# Altium schematic sheet F0_BUCK_2021-12-07.schdoc
size 321 x 215 mm
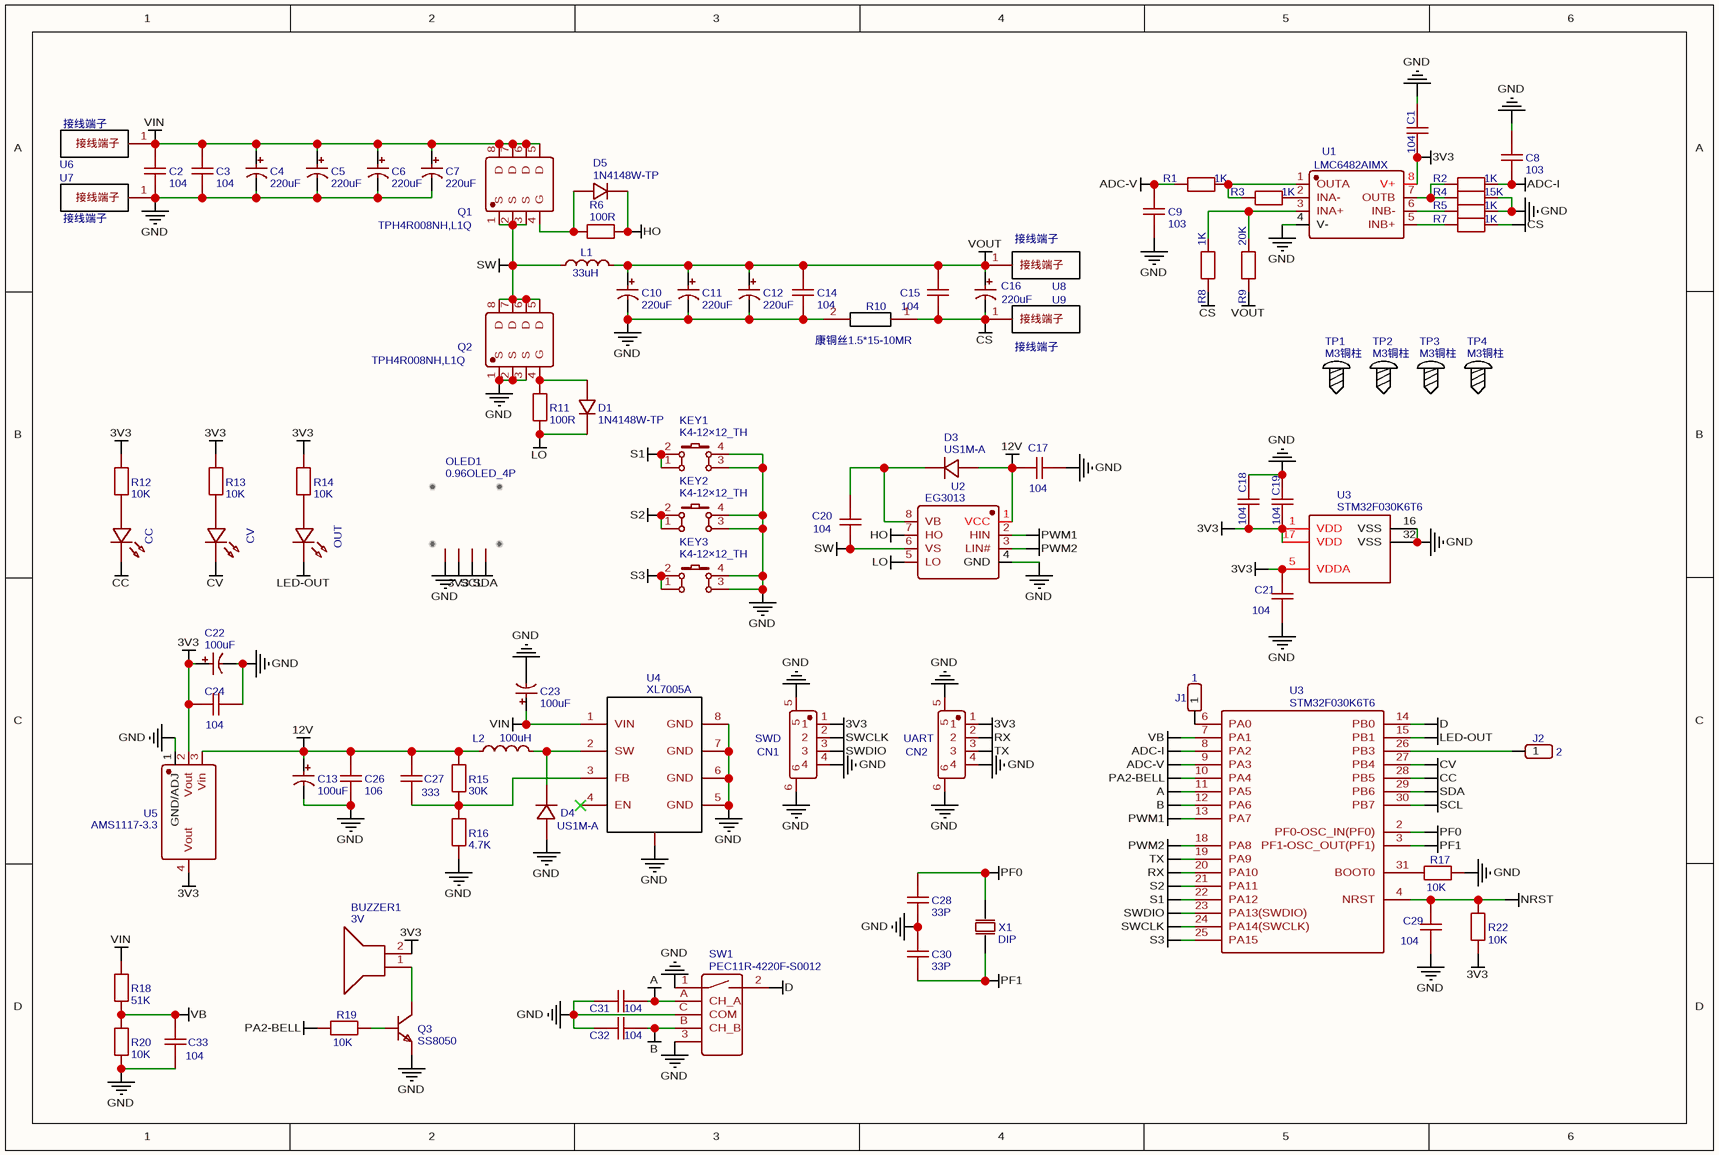
[diagram p0: F0_BUCK_2021-12-07.schdoc]

## Parts
(Parts that share a designator on the sheet are numbered #1, #2 ... from top to bottom, then left to right.)
BUZZER1  3V  [BUZ-TH_BD12.5-P6.50-D0.9]
C1  104  [C0603]
C2  104  [C1206]
C3  104  [C1206]
C4  220uF  [CAP-TH_BD10.0-P5.00-D1.0-FD]
C5  220uF  [CAP-TH_BD10.0-P5.00-D1.0-FD]
C6  220uF  [CAP-TH_BD10.0-P5.00-D1.0-FD]
C7  220uF  [CAP-TH_BD10.0-P5.00-D1.0-FD]
C8  103  [C0603]
C9  103  [C0603]
C10  220uF  [CAP-TH_BD10.0-P5.00-D1.0-FD]
C11  220uF  [CAP-TH_BD10.0-P5.00-D1.0-FD]
C12  220uF  [CAP-TH_BD10.0-P5.00-D1.0-FD]
C13  100uF  [CAP-TH_BD8.0-P3.50-D1.0-FD]
C14  104  [C1206]
C15  104  [C1206]
C16  220uF  [CAP-TH_BD10.0-P5.00-D1.0-FD]
C17  104  [C0603]
C18  104  [C0603]
C19  104  [C0603]
C20  104  [C0603]
C21  104  [C0603]
C22  100uF  [CAP-TH_BD8.0-P3.50-D1.0-FD]
C23  100uF  [CAP-TH_BD8.0-P3.50-D1.0-FD]
C24  104  [C0603]
C26  106  [C0805]
C27  333  [C0603]
C28  33P  [C0603]
C29  104  [C0603]
C30  33P  [C0603]
C31  104  [C0603]
C32  104  [C0603]
C33  104  [C0603]
CC  CC  [LED-TH_BD3.0_RED]  (value not drawn)
CN1  SWD  [CONN-SMD_1.5-4P-LT]
CN2  UART  [CONN-SMD_1.5-4P-LT]
CV  LED-TH-3mm_G  [LED-TH_BD3.0_GREEN]  (value not drawn)
D1  1N4148W-TP  [SOD-123_L2.8-W1.8-LS3.7-RD]
D3  US1M-A  [SMA_L4.4-W2.8-LS5.4-RD]
D4  US1M-A  [SMA_L4.4-W2.8-LS5.4-RD]
D5  1N4148W-TP  [SOD-123_L2.8-W1.8-LS3.7-RD]
J1  1  [HDR-M-2.54_1X1]
J2  2  [HDR-M-2.54_1X1]
KEY1  K4-12×12_TH  [KEY-TH_4P-L12.0-W12.0-P5.00-LS12.5]
KEY2  K4-12×12_TH  [KEY-TH_4P-L12.0-W12.0-P5.00-LS12.5]
KEY3  K4-12×12_TH  [KEY-TH_4P-L12.0-W12.0-P5.00-LS12.5]
L1  33uH  [IND-TH_L29.0-W12.0-P10.00]
L2  100uH  [IND-SMD_L7.1-W7.0]
OLED1  0.96OLED_4P  [0.96OLED_4P]
OUT  OUT  [LED-TH_BD3.0_BLUE]  (value not drawn)
Q1  TPH4R008NH,L1Q  [POWERVDFN-8_L5.0-W5.0-P1.27-LS6.0-BL]
Q2  TPH4R008NH,L1Q  [POWERVDFN-8_L5.0-W5.0-P1.27-LS6.0-BL]
Q3  SS8050  [SOT-23-3_L2.9-W1.3-P1.90-LS2.4-BR]
R1  1K  [R0603]
R2  1K  [R0603]
R3  1K  [R0603]
R4  15K  [R0603]
R5  1K  [R0603]
R6  100R  [R0603]
R7  1K  [R0603]
R8  1K  [R0603]
R9  20K  [R0603]
R10  康铜丝1.5*15-10MR  [康铜丝1.5*15-10MR]
R11  100R  [R0603]
R12  10K  [R0603]
R13  10K  [R0603]
R14  10K  [R0603]
R15  30K  [R0603]
R16  4.7K  [R0603]
R17  10K  [R0603]
R18  51K  [R0603]
R19  10K  [R0603]
R20  10K  [R0603]
R22  10K  [R0603]
SW1  PEC11R-4220F-S0012  [SW-TH_PEC11R-4220F-S0012]
TP1  M3铜柱  [M3铜柱]
TP2  M3铜柱  [M3铜柱]
TP3  M3铜柱  [M3铜柱]
TP4  M3铜柱  [M3铜柱]
U1  LMC6482AIMX  [SOIC-8_L4.9-W3.9-P1.27-LS6.0-BL]
U2  EG3013  [SOP-8_L5.0-W4.0-P1.27-LS6.2-BL]
U3#1  STM32F030K6T6  [TQFP-32_L7.0-W7.0-P0.50-BL]
U3#2  STM32F030K6T6  [TQFP-32_L7.0-W7.0-P0.50-BL]
U4  XL7005A  [SOIC-8_L5.0-W4.0-P1.27-LS6.0-BL-EP]
U5  AMS1117-3.3  [SOT-223-3_L6.5-W3.4-P2.30-LS7.0-BR]
U6  接线端子  [4MM端子]
U7  接线端子  [4MM端子]
U8  接线端子  [4MM端子]
U9  接线端子  [4MM端子]
X1  DIP  [HC-49US_L11.5-W4.5-P4.88]

## Nets
3V3: BUZZER1.2 C1.1 C18.1 C19.1 C21.2 C22.1 C24.2 CN1.1 CN2.1 OLED1.2 R12.2 R13.2 R14.2 R22.1 U1.8(V+) U3#1.1(VDD) U3#1.5(VDDA) U3#1.17(VDD) U5.2(Vout) U5.4(Vout)
12V: C13.1 C17.1 C26.2 C27.2 D3.2(A) L2.1 R15.2 U2.1(VCC) U5.3(Vin)
A: C31.1 SW1.A(CH_A) U3#2.11(PA5)
ADC-I: C8.1 R2.2 U3#2.8(PA2)
ADC-V: C9.2 R1.1 U3#2.9(PA3)
B: C32.1 SW1.B(CH_B) U3#2.12(PA6)
CC: CC.2 U3#2.28(PB5)
CS: C15.1 C16.2 R7.2 R8.1 R10.1 U9.1(接线端子)
CV: CV.2 U3#2.27(PB4)
D: SW1.2 U3#2.14(PB0)
GND: C1.2 C2.1 C3.1 C4.2 C5.2 C6.2 C7.2 C8.2 C9.1 C10.2 C11.2 C12.2 C13.2 C14.1 C17.2 C18.2 C19.2 C21.1 C22.2 C23.2 C24.1 C26.1 C28.1 C29.1 C30.2 C31.2 C32.2 C33.1 CN1.4 CN1.5 CN1.6 CN2.4 CN2.5 CN2.6 D4.2(A) KEY1.3 KEY1.4 KEY2.3 KEY2.4 KEY3.3 KEY3.4 OLED1.1 Q2.1(S) Q2.2(S) Q2.3(S) Q3.2(E) R4.2 R5.2 R10.2 R16.1 R17.2 R20.1 SW1.1 SW1.3 SW1.C(COM) U1.4(V-) U2.4(GND) U3#1.16(VSS) U3#1.32(VSS) U4.5(GND) U4.6(GND) U4.7(GND) U4.8(GND) U4.9 U5.1(GND/ADJ) U7.1(接线端子)
HO: D5.1(c) R6.1 U2.7(HO)
LED-OUT: OUT.2 U3#2.15(PB1)
LO: D1.1(c) R11.1 U2.5(LO)
NRST: C29.2 R22.2 U3#2.4(NRST)
PA2-BELL: R19.1 U3#2.10(PA4)
PF0: C28.2 U3#2.2(PF0-OSC_IN(PF0)) X1.2(OSC2)
PF1: C30.1 U3#2.3(PF1-OSC_OUT(PF1)) X1.1(OSC1)
PWM1: U2.2(HIN) U3#2.13(PA7)
PWM2: U2.3(LIN#) U3#2.18(PA8)
RX: CN2.2 U3#2.20(PA10)
S1: KEY1.1 KEY1.2 U3#2.22(PA12)
S2: KEY2.1 KEY2.2 U3#2.21(PA11)
S3: KEY3.1 KEY3.2 U3#2.25(PA15)
SCL: OLED1.3 U3#2.30(PB7)
SDA: OLED1.4 U3#2.29(PB6)
SW: C20.2 L1.1 Q1.1(S) Q1.2(S) Q1.3(S) Q2.5(D) Q2.6(D) Q2.7(D) Q2.8(D) U2.6(VS)
SWCLK: CN1.2 U3#2.24(PA14(SWCLK))
SWDIO: CN1.3 U3#2.23(PA13(SWDIO))
TX: CN2.3 U3#2.19(PA9)
VB: C33.2 R18.1 R20.2 U3#2.7(PA1)
VIN: C2.2 C3.2 C4.1 C5.1 C6.1 C7.1 C23.1 Q1.5(D) Q1.6(D) Q1.7(D) Q1.8(D) R18.2 U4.1(VIN) U6.1(接线端子)
VOUT: C10.1 C11.1 C12.1 C14.2 C15.2 C16.1 L1.2 R9.1 U8.1(接线端子)
NetBUZZER1_1: BUZZER1.1 Q3.3(C)
NetC20_1: C20.1 D3.1(C) U2.8(VB)
NetC27_1: C27.1 R15.1 R16.2 U4.3(FB)
NetCC_1: CC.1 R12.1
NetCV_1: CV.1 R13.1
NetD1_2: D1.2(A) Q2.4(G) R11.2
NetD4_1: D4.1(C) L2.2 U4.2(SW)
NetD5_2: D5.2(A) Q1.4(G) R6.2
NetJ1_1: J1.1 U3#2.6(PA0)
NetJ2_1: J2.1 U3#2.26(PB3)
NetOUT_1: OUT.1 R14.1
NetQ3_1: Q3.1(B) R19.2
NetR1_2: R1.2 R3.1 U1.1(OUTA)
NetR2_1: R2.1 R4.1 U1.7(OUTB)
NetR3_2: R3.2 U1.2(INA-)
NetR5_1: R5.1 U1.6(INB-)
NetR7_1: R7.1 U1.5(INB+)
NetR8_2: R8.2 R9.2 U1.3(INA+)
NetR17_1: R17.1 U3#2.31(BOOT0)

Not connected (* = marked no-connect by the designer): U4 4(EN)*

## Notes on the sheet
- (in symbol 0.96OLED_4P) Hello World!!!

## Library data of the parts
BUZZER1 = 3V: BOM_Manufacturer: ZLFY; BOM_Manufacturer Part: ZL-YDW12055-4005PA-6.5; Contributor: LCSC; BOM_Supplier: LCSC; BOM_Supplier Part: C219731; BOM_JLCPCB Part Class: Extended Part; spicePre: B; spiceSymbolName: ZL-YDW12055-4005PA-6.5
C1-C3 C14 C15 C17-C21 C24 C29 C31-C33 = 104: nameAlias: Value(F); Contributor: LCEDA_Lib; spicePre: C
  C1 C17-C21 C24 C29 C31-C33: spiceSymbolName: C_0603_US
  C2 C3 C14 C15: spiceSymbolName: C_1206_US
C4-C7 C10-C12 C16 = 220uF: BOM_Manufacturer: ValuePro; BOM_Manufacturer Part: 220uF 50V 10*13; nameAlias: Capacitance; BOM_Supplier: LCSC; BOM_Supplier Part: C45105; BOM_JLCPCB Part Class: Extended Part; spicePre: C; spiceSymbolName: 220uF 50V 10*13
C8 C9 = 103: nameAlias: Value(F); Contributor: LCEDA_Lib; spicePre: C; spiceSymbolName: C_0603_US
C13 C22 C23 = 100uF: BOM_Manufacturer: ValuePro; BOM_Manufacturer Part: 100uF 50V 8*12Black high frequency; nameAlias: Capacitance; BOM_Supplier: LCSC; BOM_Supplier Part: C45102; spicePre: C; spiceSymbolName: 100uF 50V 8*12Black high frequency
C26 = 106: nameAlias: Value(F); Contributor: LCEDA_Lib; spicePre: C; spiceSymbolName: C_0805_US
C27 = 333: nameAlias: Value(F); Contributor: LCEDA_Lib; spicePre: C; spiceSymbolName: C_0603_US
C28 C30 = 33P: nameAlias: Value(F); Contributor: LCEDA_Lib; spicePre: C; spiceSymbolName: C_0603_US
CC = CC: BOM_Manufacturer: EVERLIGHT(台湾亿光); BOM_Manufacturer Part: 204-10SDRD/S530-A3-L; Contributor: LCEDA_Lib; BOM_Supplier Part: C84774; BOM_Supplier: LCSC; spicePre: L; spiceSymbolName: LED-TH-3mm_R
CN1 = SWD: BOM_Manufacturer: SHOU HAN(首韩); BOM_Manufacturer Part: 1.5-4P LT; Contributor: LCSC; BOM_Supplier: LCSC; BOM_Supplier Part: C2681532; JLCPCB Part Class: Extended Part; spicePre: C; spiceSymbolName: 1.5-4P LT
CN2 = UART: BOM_Manufacturer: SHOU HAN(首韩); BOM_Manufacturer Part: 1.5-4P LT; Contributor: LCSC; BOM_Supplier: LCSC; BOM_Supplier Part: C2681532; JLCPCB Part Class: Extended Part; spicePre: C; spiceSymbolName: 1.5-4P LT
CV = LED-TH-3mm_G: BOM_Manufacturer: EVERLIGHT(台湾亿光); BOM_Manufacturer Part: 204-10SYGD/S530-E3; Contributor: LCEDA_Lib; BOM_Supplier Part: C85161; spicePre: L; spiceSymbolName: LED-TH-3mm_G
D1 D5 = 1N4148W-TP: BOM_Manufacturer: MCC; BOM_Supplier: LCSC; BOM_Manufacturer Part: 1N4148W-TP; BOM_Supplier Part: C77978; BOM_JLCPCB Part Class: Extended Part; spicePre: D; spiceSymbolName: 1N4148W-TP
D3 D4 = US1M-A: BOM_Manufacturer: FMS; Contributor: LCSC; BOM_Supplier: LCSC; BOM_Manufacturer Part: US1M-A; BOM_Supplier Part: C143206; BOM_JLCPCB Part Class: Extended Part; spicePre: D; spiceSymbolName: US1M-A
J1 = 1: Contributor: LCEDA_Lib; BOM_Supplier Part: C81276; BOM_Supplier: LCSC; spicePre: J; spiceSymbolName: HDR-M-2.54_1x1
J2 = 2: Contributor: LCEDA_Lib; BOM_Supplier Part: C81276; BOM_Supplier: LCSC; spicePre: J; spiceSymbolName: HDR-M-2.54_1x1
KEY1-KEY3 = K4-12×12_TH: BOM_Manufacturer: 韩国韩荣; BOM_Manufacturer Part: K2-1103DP-M4SW-04; Contributor: LCEDA_Lib; BOM_Supplier Part: C128053; BOM_Supplier: LCSC; spicePre: K; spiceSymbolName: K4-12×12_TH
L1 = 33uH: BOM_Manufacturer: Sunltech Tech; BOM_Manufacturer Part: SLT092125T220MTB; Contributor: LCSC; BOM_Supplier: LCSC; BOM_Supplier Part: C908344; JLCPCB Part Class: Extended Part; spicePre: L; spiceSymbolName: SLT092125T220MTB
L2 = 100uH: BOM_Manufacturer: Meled Industrial; BOM_Manufacturer Part: CDRH74-101; nameAlias: Inductance; Contributor: LCSC; BOM_Supplier: LCSC; BOM_Supplier Part: C85276; BOM_JLCPCB Part Class: Extended Part; spicePre: L; spiceSymbolName: CDRH74-101
OLED1 = 0.96OLED_4P: Contributor: LCEDA_Lib; BOM_Supplier: LCSC; spicePre: O; spiceSymbolName: 0.96OLED_4P
OUT = OUT: BOM_Manufacturer: EVERLIGHT(台湾亿光); BOM_Manufacturer Part: 204-10SUBC/S400-A4; Contributor: LCEDA_Lib; BOM_Supplier Part: C86881; BOM_Supplier: LCSC; spicePre: L; spiceSymbolName: LED-TH-3mm_B
Q1 Q2 = TPH4R008NH,L1Q: BOM_Manufacturer: TOSHIBA; Contributor: LCSC; BOM_Supplier: LCSC; BOM_Manufacturer Part: TPH4R008NH,L1Q; BOM_Supplier Part: C141587; BOM_JLCPCB Part Class: Extended Part; spicePre: Q; spiceSymbolName: TPH4R008NH,L1Q
Q3 = SS8050: BOM_Manufacturer: FUXINSEMI; Contributor: LCSC; BOM_Supplier: LCSC; BOM_Supplier Part: C908250; BOM_Manufacturer Part: SS8050; BOM_JLCPCB Part Class: Extended Part; spicePre: Q; spiceSymbolName: SS8050
R1-R3 R5 R7 R8 = 1K: nameAlias: Value(Ω); Contributor: LCEDA_Lib; spicePre: R; spiceSymbolName: R_0603_EU
R4 = 15K: nameAlias: Value(Ω); Contributor: LCEDA_Lib; spicePre: R; spiceSymbolName: R_0603_EU
R6 R11 = 100R: nameAlias: Value(Ω); Contributor: LCEDA_Lib; spicePre: R; spiceSymbolName: R_0603_EU
R9 = 20K: nameAlias: Value(Ω); Contributor: LCEDA_Lib; spicePre: R; spiceSymbolName: R_0603_EU
R10 = 康铜丝1.5*15-10MR: Contributor: FXLER; BOM_Manufacturer: ?; BOM_Manufacturer Part: ?; BOM_Supplier Part: ?; spicePre: R; spiceSymbolName: 康铜丝1.5*15-10MR
R12-R14 R17 R19 R20 R22 = 10K: nameAlias: Value(Ω); Contributor: LCEDA_Lib; spicePre: R; spiceSymbolName: R_0603_EU
R15 = 30K: nameAlias: Value(Ω); Contributor: LCEDA_Lib; spicePre: R; spiceSymbolName: R_0603_EU
R16 = 4.7K: nameAlias: Value(Ω); Contributor: LCEDA_Lib; spicePre: R; spiceSymbolName: R_0603_EU
R18 = 51K: nameAlias: Value(Ω); Contributor: LCEDA_Lib; spicePre: R; spiceSymbolName: R_0603_EU
SW1 = PEC11R-4220F-S0012: BOM_Manufacturer: BOURNS; Contributor: LCSC; BOM_Supplier: LCSC; BOM_Manufacturer Part: PEC11R-4220F-S0012; BOM_Supplier Part: C143817; BOM_JLCPCB Part Class: Extended Part; spicePre: S; spiceSymbolName: PEC11R-4220F-S0012
TP1-TP4 = M3铜柱: Contributor: 立创EDA电子小制作; spicePre: T; spiceSymbolName: M3铜柱
U1 = LMC6482AIMX: BOM_Manufacturer: TI(德州仪器); Contributor: LCSC; BOM_Supplier: LCSC; BOM_Supplier Part: C842776; BOM_Manufacturer Part: LMC6482AIMX; BOM_JLCPCB Part Class: Extended Part; spicePre: U; spiceSymbolName: LMC6482AIMX
U2 = EG3013: BOM_Manufacturer: EG; BOM_Supplier: LCSC; BOM_Manufacturer Part: EG3013; BOM_Supplier Part: C81710; BOM_JLCPCB Part Class: Extended Part; spicePre: U; spiceSymbolName: EG3013
U3#1 U3#2 = STM32F030K6T6: BOM_Manufacturer: ST; subpart_no: 1; tags: STM32; timeStamp: 1450544170; BOM_Supplier Part: C46830; BOM_Supplier: LCSC; BOM_Manufacturer Part: STM32F030K6T6; image: http://image.lceda.cn/szlcsc/C46830.jpg; spicePre: U; spiceSymbolName: STM32F030K6T6
U4 = XL7005A: BOM_Manufacturer: XLSEMI; BOM_Supplier: LCSC; BOM_Manufacturer Part: XL7005A; image: //image.lceda.cn/szlcsc/C50848.jpg; BOM_Supplier Part: C50848; BOM_JLCPCB Part Class: Extended Part; spicePre: U; spiceSymbolName: XL7005A
U5 = AMS1117-3.3: BOM_Manufacturer: AMS; sourceId: dwIGgezVh; timeStamp: 1476261164; BOM_Supplier: LCSC; BOM_Manufacturer Part: AMS1117-3.3; image: //image.lceda.cn/szlcsc/C6186.jpg; BOM_Supplier Part: C6186; BOM_JLCPCB Part Class: Basic Part; spicePre: U; spiceSymbolName: AMS1117-3.3
U6-U9 = 接线端子: Contributor: liaozhelin; spicePre: U; spiceSymbolName: 接线端子
X1 = DIP: BOM_Manufacturer: TXC; BOM_Manufacturer Part: 9B20xxxxx1-AAE2S; nameAlias: Value; BOM_Supplier: LCSC; BOM_Supplier Part: C97180; spicePre: X; spiceSymbolName: 9B20xxxxx1-AAE2S